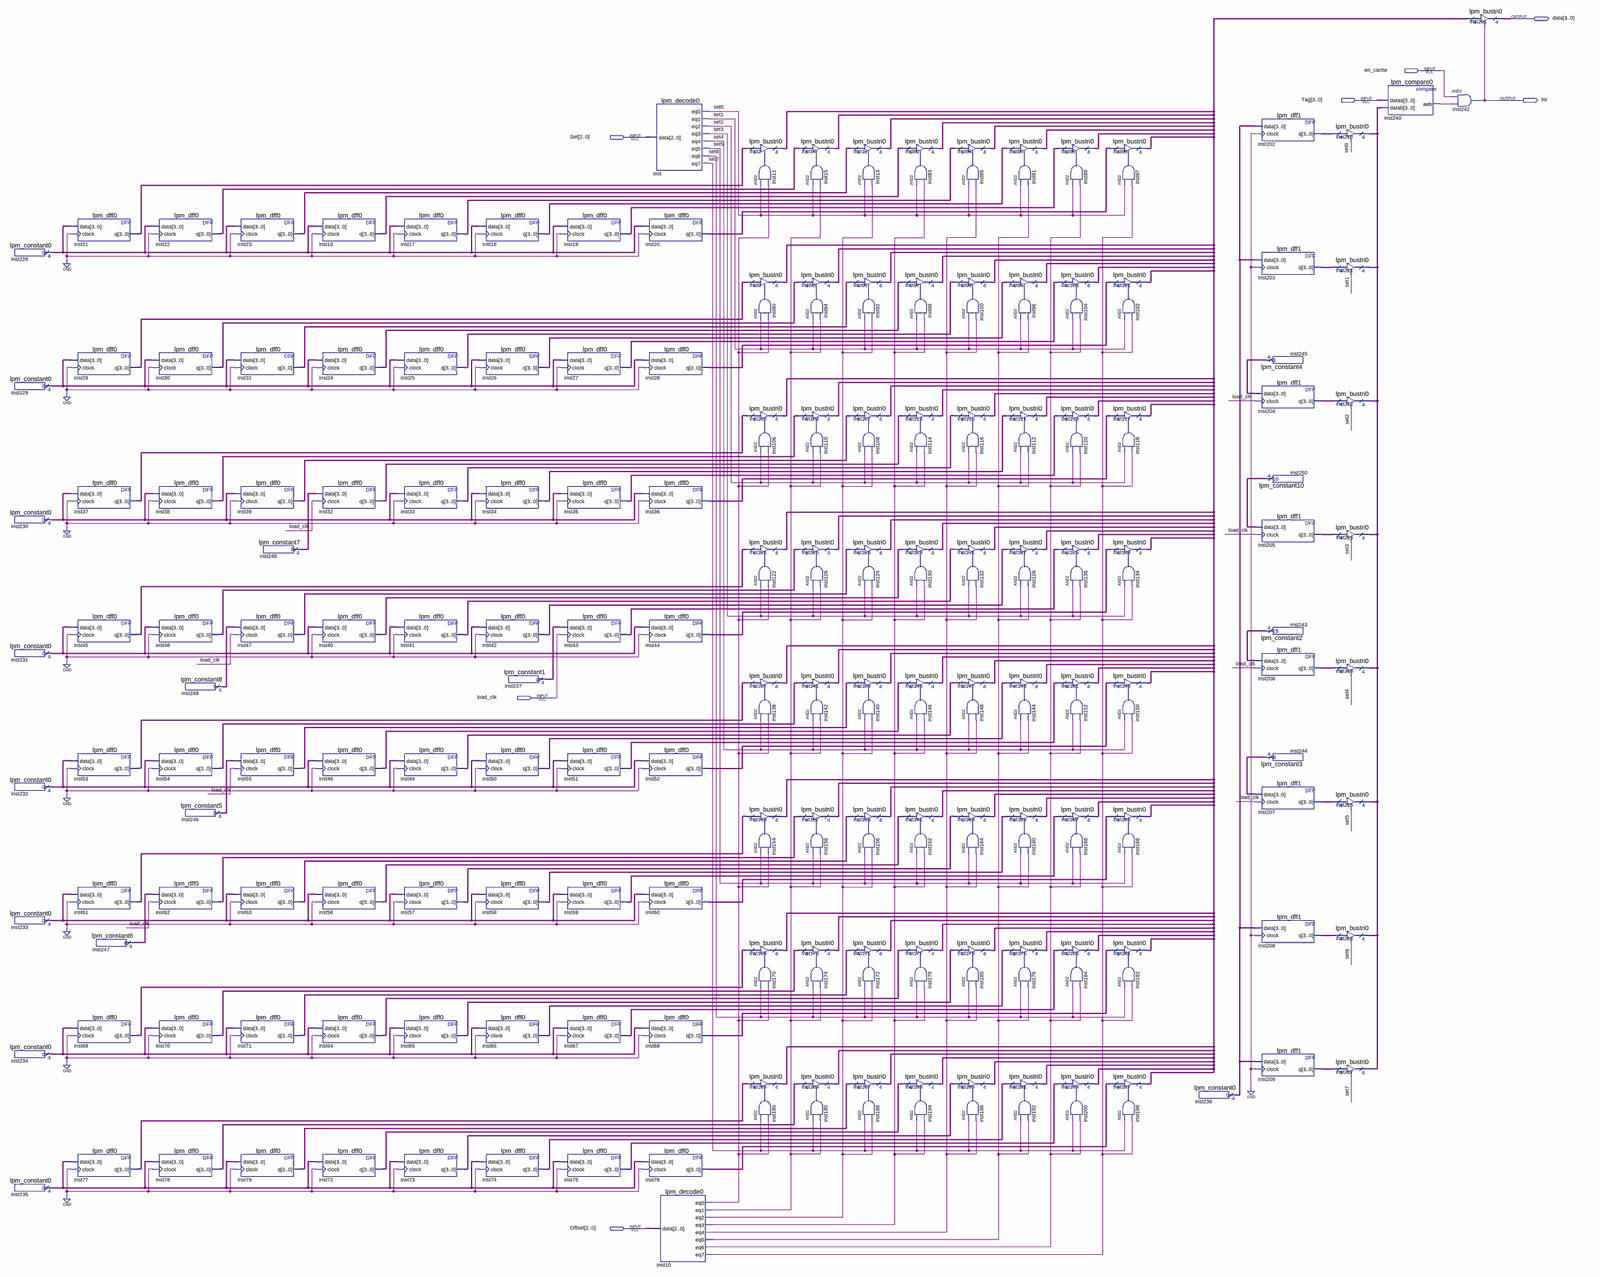
[diagram p0: schematic sheet, whole]
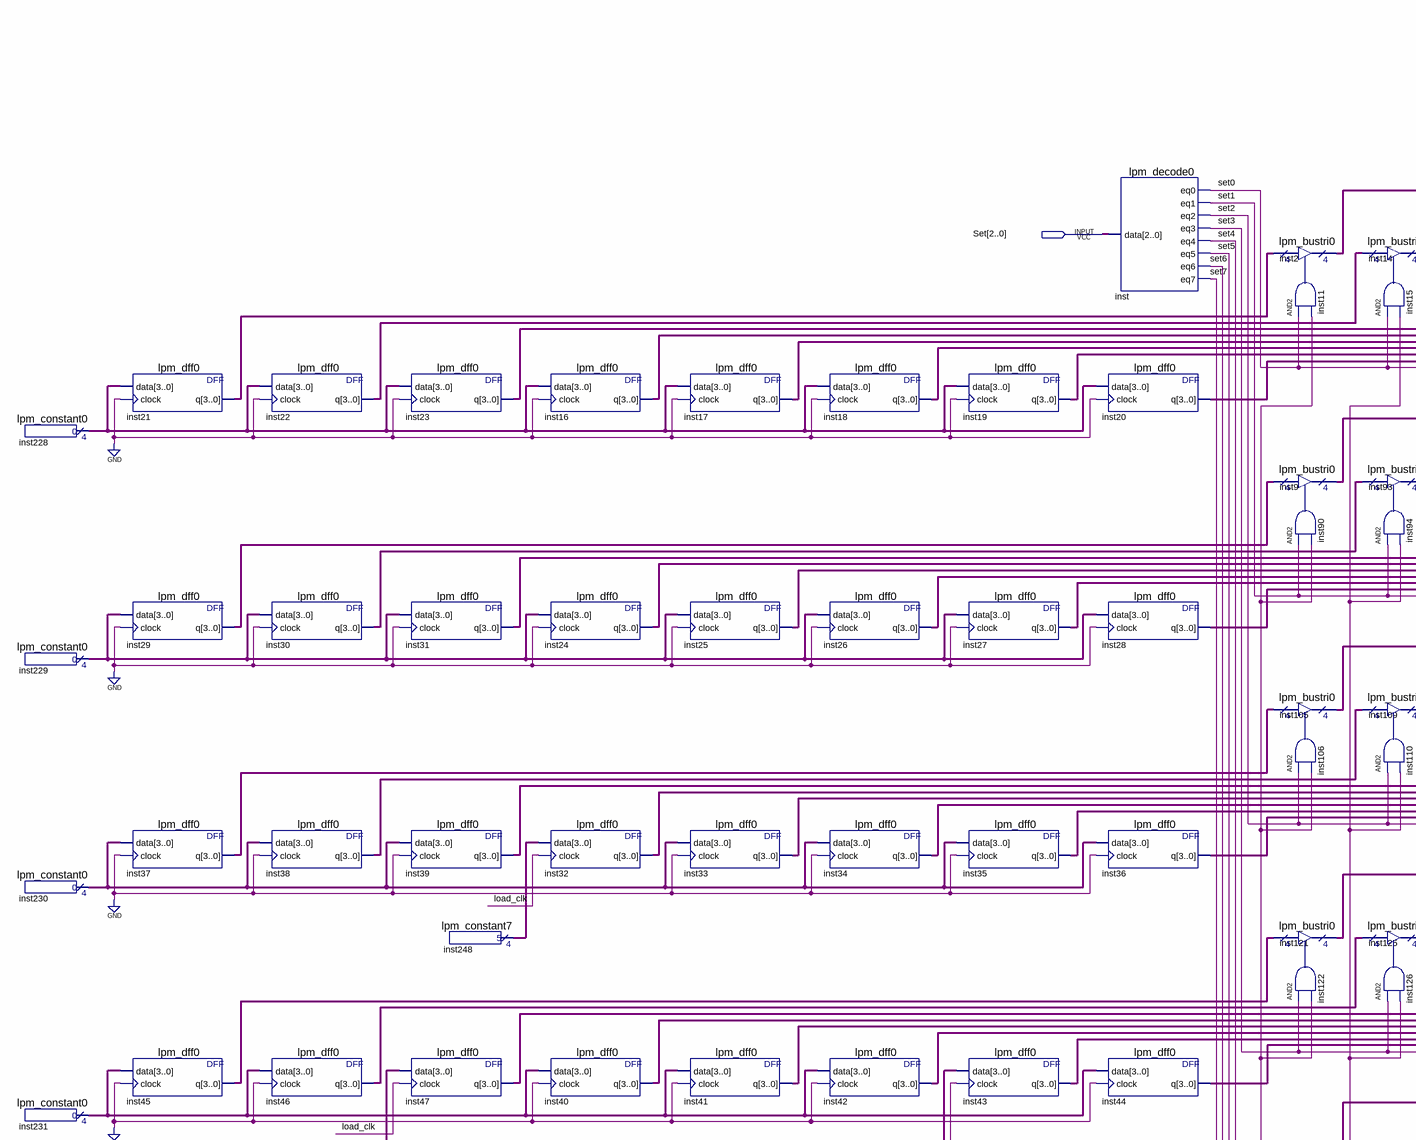
[diagram p1: schematic sheet, upper left part]
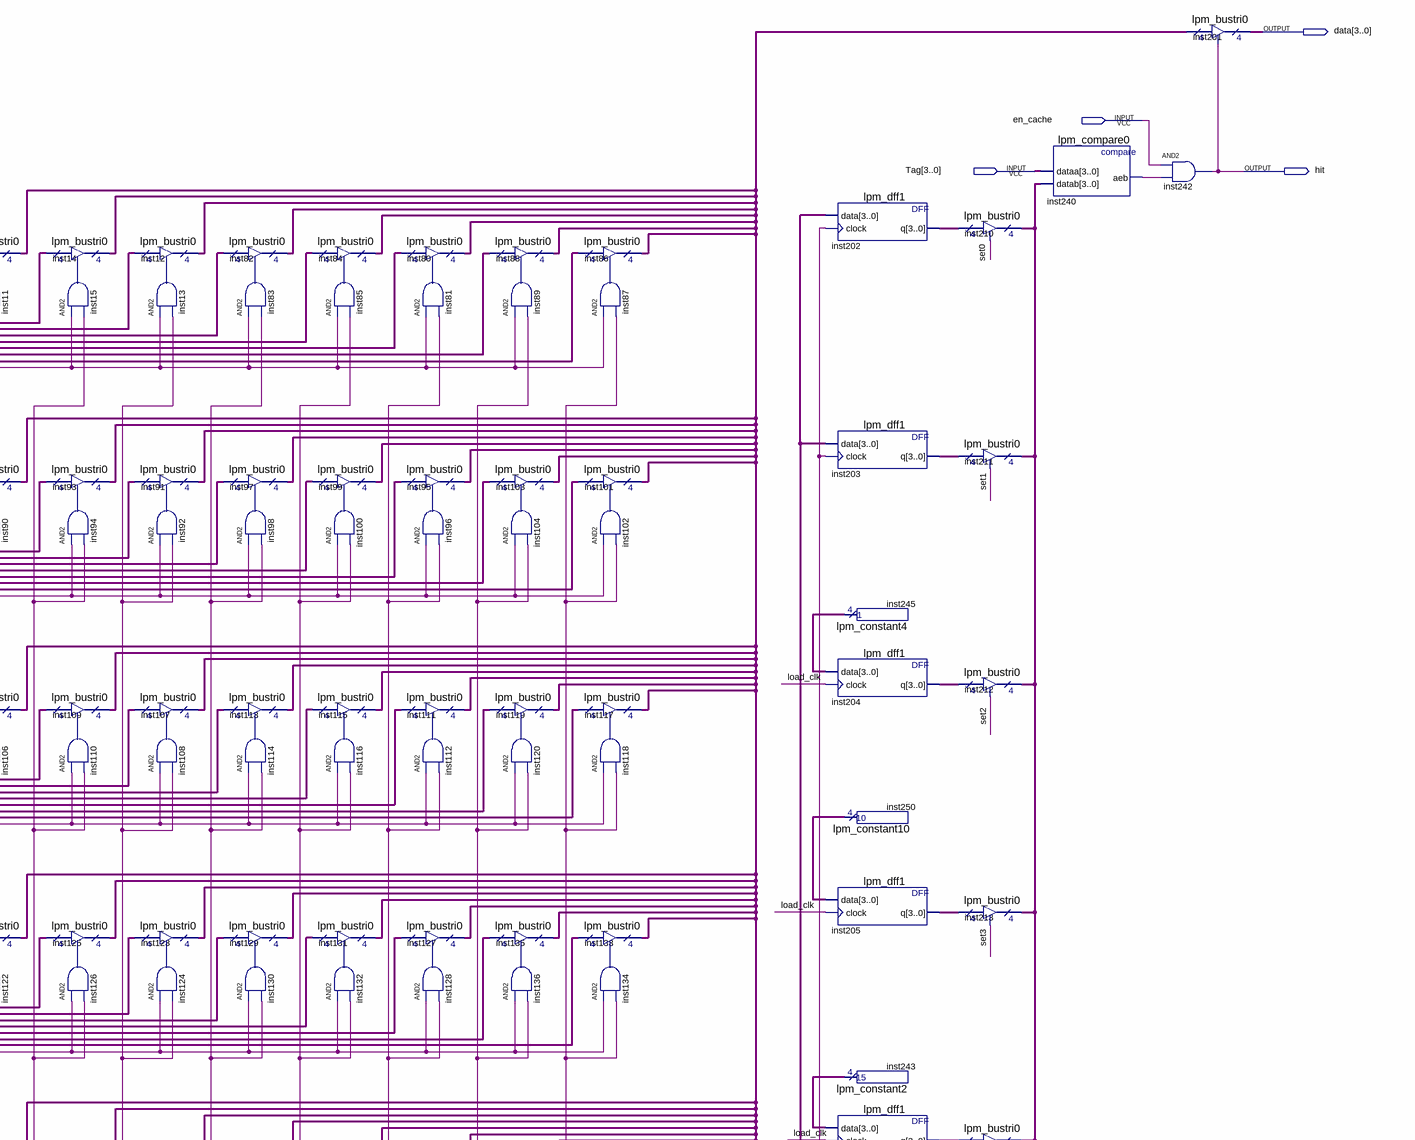
[diagram p2: schematic sheet, upper right part]
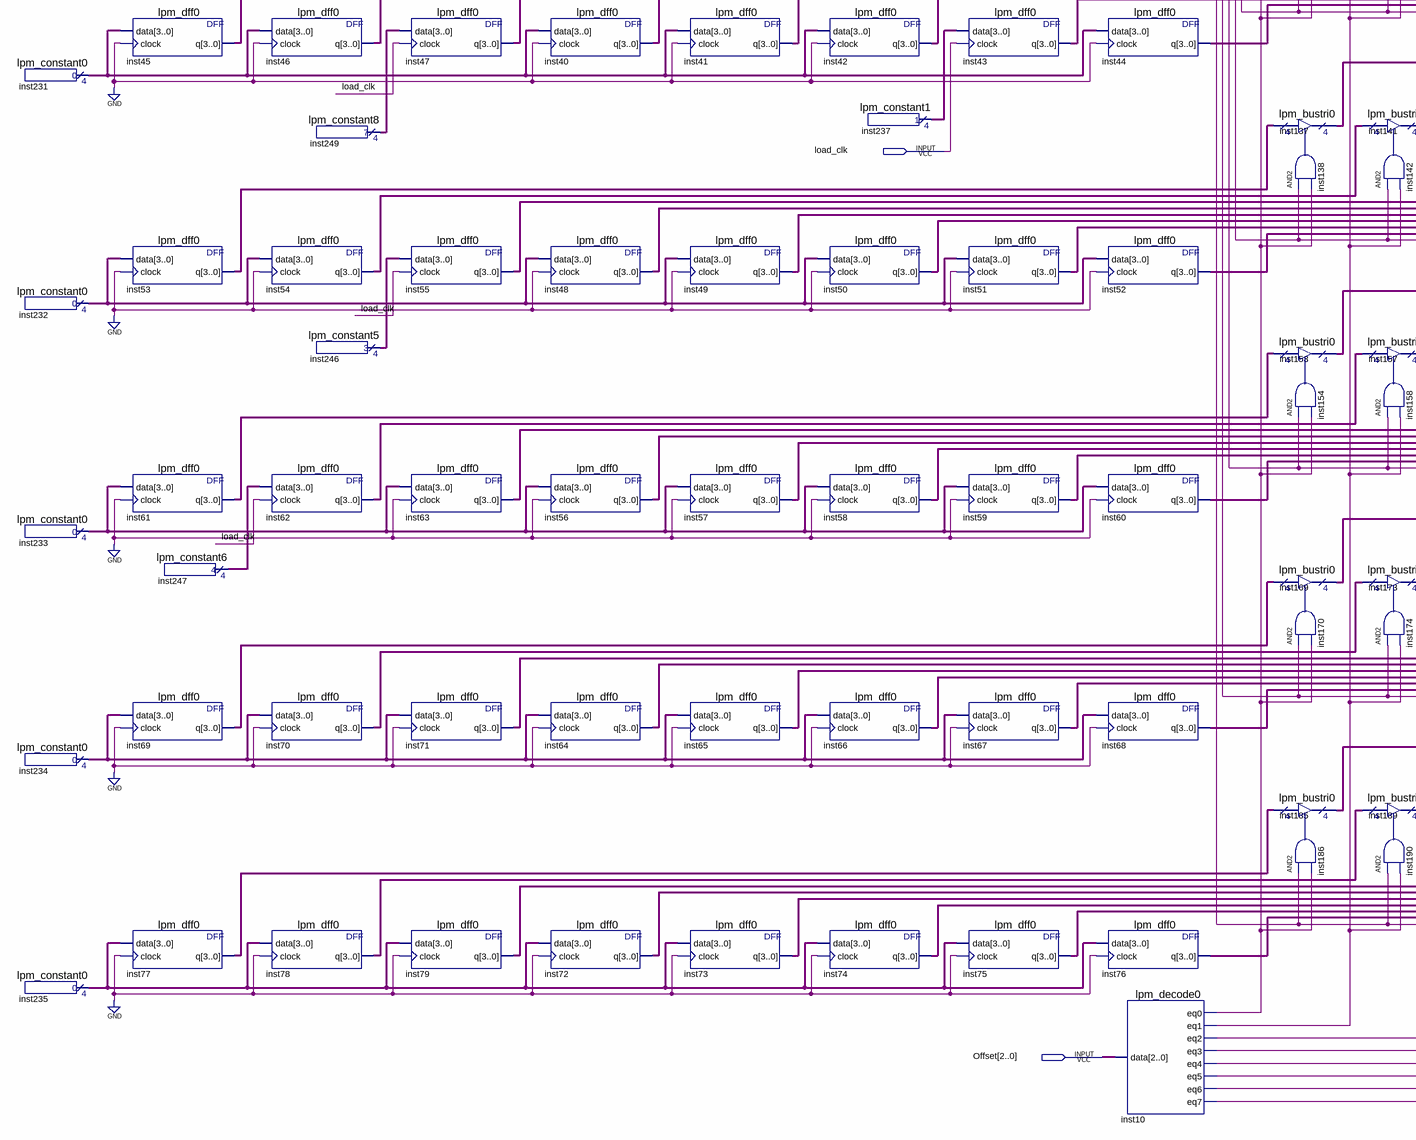
[diagram p3: schematic sheet, lower left part]
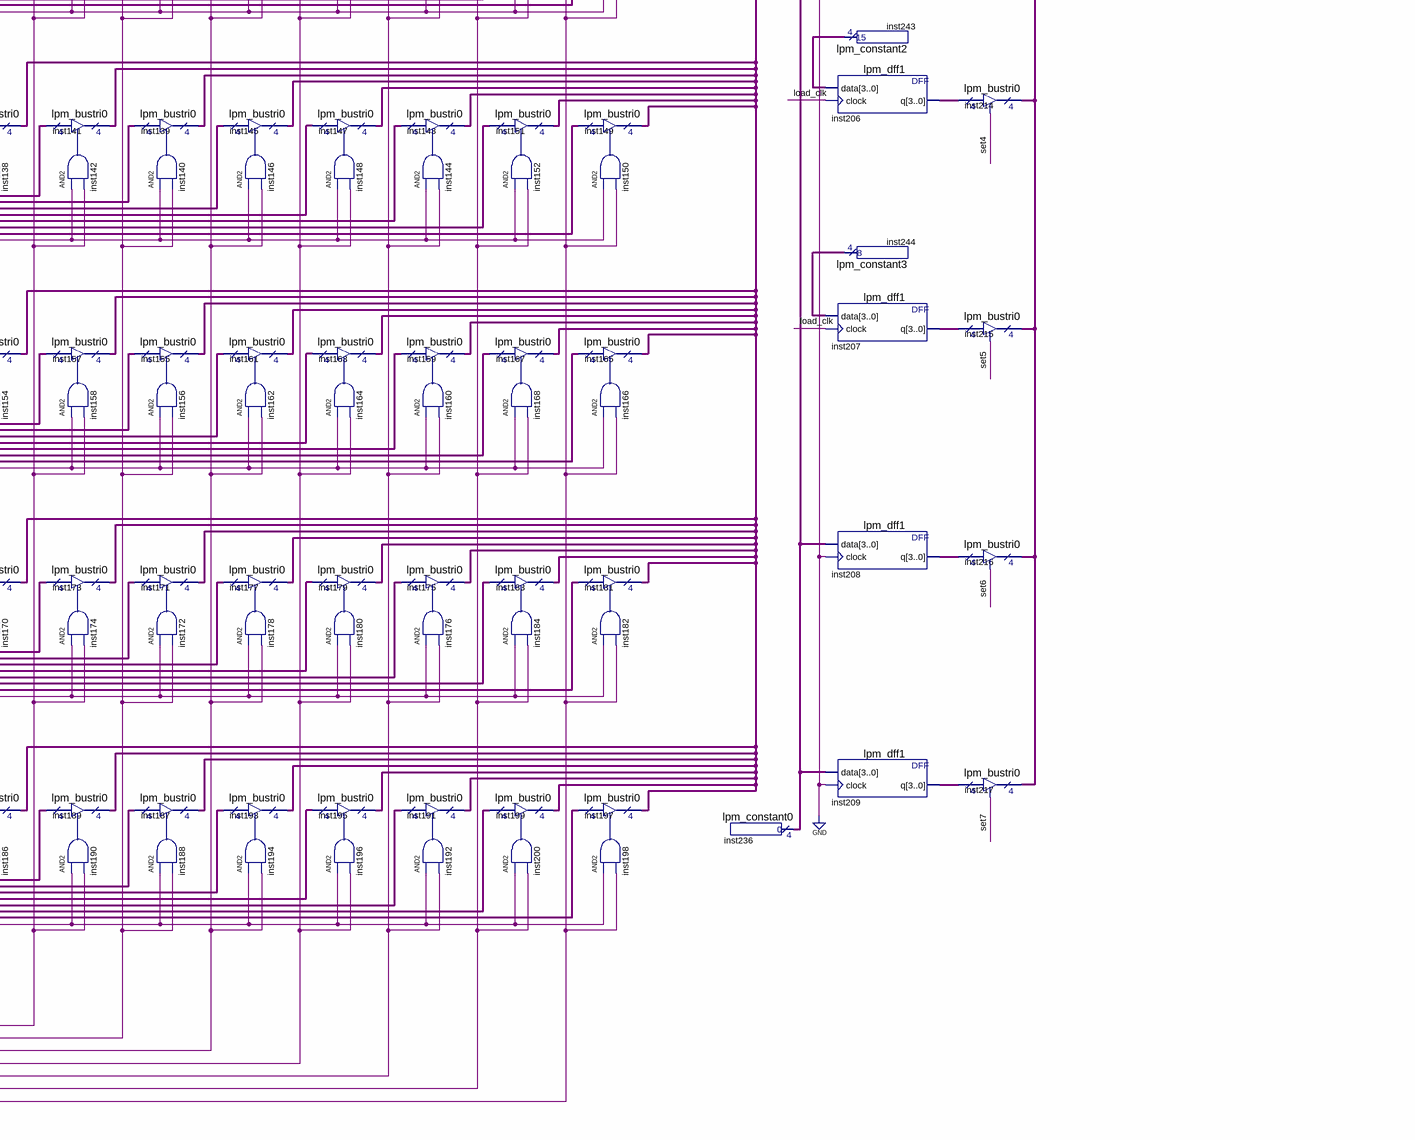
[diagram p4: schematic sheet, lower right part]
// Quartus schematic Cache.bdf as structural Verilog: 231 symbols, 7 pins
module Cache (
  input  en_cache,
  input  [3:0] Tag,
  input  [2:0] Set,
  input  load_clk,
  input  [2:0] Offset,
  output [3:0] data,
  output hit
);

  wire inst10_eq0, inst10_eq1, inst10_eq2, inst10_eq3, inst10_eq4, inst10_eq5, inst10_eq6, inst10_eq7,
       inst11_out, inst13_out, inst15_out, inst81_out, inst83_out, inst85_out, inst87_out, inst89_out,
       inst90_out, inst92_out, inst94_out, inst96_out, inst98_out, inst100_out, inst102_out, inst104_out,
       inst106_out, inst108_out, inst110_out, inst112_out, inst114_out, inst116_out, inst118_out,
       inst120_out, inst122_out, inst124_out, inst126_out, inst128_out, inst130_out, inst132_out,
       inst134_out, inst136_out, inst138_out, inst140_out, inst142_out, inst144_out, inst146_out,
       inst148_out, inst150_out, inst152_out, inst154_out, inst156_out, inst158_out, inst160_out,
       inst162_out, inst164_out, inst166_out, inst168_out, inst170_out, inst172_out, inst174_out,
       inst176_out, inst178_out, inst180_out, inst182_out, inst184_out, inst186_out, inst188_out,
       inst190_out, inst192_out, inst194_out, inst196_out, inst198_out, inst200_out, inst240_aeb, set3, set4,
       set5, set6, set7;
  wire [3:0] inst2_tridata, inst16_q, inst17_q, inst18_q, inst19_q, inst20_q, inst21_q, inst22_q, inst23_q,
       inst24_q, inst25_q, inst26_q, inst27_q, inst28_q, inst29_q, inst30_q, inst31_q, inst32_q, inst33_q,
       inst34_q, inst35_q, inst36_q, inst37_q, inst38_q, inst39_q, inst40_q, inst41_q, inst42_q, inst43_q,
       inst44_q, inst45_q, inst46_q, inst47_q, inst48_q, inst49_q, inst50_q, inst51_q, inst52_q, inst53_q,
       inst54_q, inst55_q, inst56_q, inst57_q, inst58_q, inst59_q, inst60_q, inst61_q, inst62_q, inst63_q,
       inst64_q, inst65_q, inst66_q, inst67_q, inst68_q, inst69_q, inst70_q, inst71_q, inst72_q, inst73_q,
       inst74_q, inst75_q, inst76_q, inst77_q, inst78_q, inst79_q, inst202_q, inst203_q, inst204_q,
       inst205_q, inst206_q, inst207_q, inst208_q, inst209_q, inst210_tridata, inst228_result,
       inst229_result, inst230_result, inst231_result, inst232_result, inst233_result, inst234_result,
       inst235_result, inst236_result, inst237_result, inst243_result, inst244_result, inst245_result,
       inst246_result, inst247_result, inst248_result, inst249_result, inst250_result;

  lpm_constant0 inst228 (.result(inst228_result));
  lpm_constant0 inst229 (.result(inst229_result));
  lpm_constant0 inst230 (.result(inst230_result));
  lpm_constant0 inst231 (.result(inst231_result));
  lpm_constant0 inst232 (.result(inst232_result));
  lpm_constant0 inst233 (.result(inst233_result));
  lpm_constant0 inst234 (.result(inst234_result));
  lpm_constant0 inst235 (.result(inst235_result));
  lpm_dff0 inst21 (.data(inst228_result), .clock(1'b0), .q(inst21_q));
  lpm_dff0 inst29 (.data(inst229_result), .clock(1'b0), .q(inst29_q));
  lpm_dff0 inst37 (.data(inst230_result), .clock(1'b0), .q(inst37_q));
  lpm_dff0 inst45 (.data(inst231_result), .clock(1'b0), .q(inst45_q));
  lpm_dff0 inst53 (.data(inst232_result), .clock(1'b0), .q(inst53_q));
  lpm_dff0 inst61 (.data(inst233_result), .clock(1'b0), .q(inst61_q));
  lpm_dff0 inst69 (.data(inst234_result), .clock(1'b0), .q(inst69_q));
  lpm_dff0 inst77 (.data(inst235_result), .clock(1'b0), .q(inst77_q));
  lpm_constant6 inst247 (.result(inst247_result));
  lpm_dff0 inst22 (.data(inst228_result), .clock(1'b0), .q(inst22_q));
  lpm_dff0 inst30 (.data(inst229_result), .clock(1'b0), .q(inst30_q));
  lpm_dff0 inst38 (.data(inst230_result), .clock(1'b0), .q(inst38_q));
  lpm_dff0 inst46 (.data(inst231_result), .clock(1'b0), .q(inst46_q));
  lpm_dff0 inst54 (.data(inst232_result), .clock(1'b0), .q(inst54_q));
  lpm_dff0 inst62 (.data(inst247_result), .clock(load_clk), .q(inst62_q));
  lpm_dff0 inst70 (.data(inst234_result), .clock(1'b0), .q(inst70_q));
  lpm_dff0 inst78 (.data(inst235_result), .clock(1'b0), .q(inst78_q));
  lpm_constant8 inst249 (.result(inst249_result));
  lpm_constant5 inst246 (.result(inst246_result));
  lpm_dff0 inst23 (.data(inst228_result), .clock(1'b0), .q(inst23_q));
  lpm_dff0 inst31 (.data(inst229_result), .clock(1'b0), .q(inst31_q));
  lpm_dff0 inst39 (.data(inst230_result), .clock(1'b0), .q(inst39_q));
  lpm_constant7 inst248 (.result(inst248_result));
  lpm_dff0 inst47 (.data(inst249_result), .clock(load_clk), .q(inst47_q));
  lpm_dff0 inst55 (.data(inst246_result), .clock(load_clk), .q(inst55_q));
  lpm_dff0 inst63 (.data(inst233_result), .clock(1'b0), .q(inst63_q));
  lpm_dff0 inst71 (.data(inst234_result), .clock(1'b0), .q(inst71_q));
  lpm_dff0 inst79 (.data(inst235_result), .clock(1'b0), .q(inst79_q));
  lpm_dff0 inst16 (.data(inst228_result), .clock(1'b0), .q(inst16_q));
  lpm_dff0 inst24 (.data(inst229_result), .clock(1'b0), .q(inst24_q));
  lpm_dff0 inst32 (.data(inst248_result), .clock(load_clk), .q(inst32_q));
  lpm_dff0 inst40 (.data(inst231_result), .clock(1'b0), .q(inst40_q));
  lpm_dff0 inst48 (.data(inst232_result), .clock(1'b0), .q(inst48_q));
  lpm_dff0 inst56 (.data(inst233_result), .clock(1'b0), .q(inst56_q));
  lpm_dff0 inst64 (.data(inst234_result), .clock(1'b0), .q(inst64_q));
  lpm_dff0 inst72 (.data(inst235_result), .clock(1'b0), .q(inst72_q));
  lpm_dff0 inst17 (.data(inst228_result), .clock(1'b0), .q(inst17_q));
  lpm_dff0 inst25 (.data(inst229_result), .clock(1'b0), .q(inst25_q));
  lpm_dff0 inst33 (.data(inst230_result), .clock(1'b0), .q(inst33_q));
  lpm_dff0 inst41 (.data(inst231_result), .clock(1'b0), .q(inst41_q));
  lpm_dff0 inst49 (.data(inst232_result), .clock(1'b0), .q(inst49_q));
  lpm_dff0 inst57 (.data(inst233_result), .clock(1'b0), .q(inst57_q));
  lpm_dff0 inst65 (.data(inst234_result), .clock(1'b0), .q(inst65_q));
  lpm_dff0 inst73 (.data(inst235_result), .clock(1'b0), .q(inst73_q));
  lpm_dff0 inst18 (.data(inst228_result), .clock(1'b0), .q(inst18_q));
  lpm_dff0 inst26 (.data(inst229_result), .clock(1'b0), .q(inst26_q));
  lpm_dff0 inst34 (.data(inst230_result), .clock(1'b0), .q(inst34_q));
  lpm_dff0 inst42 (.data(inst231_result), .clock(1'b0), .q(inst42_q));
  lpm_dff0 inst50 (.data(inst232_result), .clock(1'b0), .q(inst50_q));
  lpm_dff0 inst58 (.data(inst233_result), .clock(1'b0), .q(inst58_q));
  lpm_dff0 inst66 (.data(inst234_result), .clock(1'b0), .q(inst66_q));
  lpm_dff0 inst74 (.data(inst235_result), .clock(1'b0), .q(inst74_q));
  lpm_constant1 inst237 (.result(inst237_result));
  lpm_dff0 inst19 (.data(inst228_result), .clock(1'b0), .q(inst19_q));
  lpm_dff0 inst27 (.data(inst229_result), .clock(1'b0), .q(inst27_q));
  lpm_dff0 inst35 (.data(inst230_result), .clock(1'b0), .q(inst35_q));
  lpm_dff0 inst43 (.data(inst237_result), .clock(load_clk), .q(inst43_q));
  lpm_dff0 inst51 (.data(inst232_result), .clock(1'b0), .q(inst51_q));
  lpm_dff0 inst59 (.data(inst233_result), .clock(1'b0), .q(inst59_q));
  lpm_dff0 inst67 (.data(inst234_result), .clock(1'b0), .q(inst67_q));
  lpm_dff0 inst75 (.data(inst235_result), .clock(1'b0), .q(inst75_q));
  lpm_dff0 inst20 (.data(inst228_result), .clock(1'b0), .q(inst20_q));
  lpm_dff0 inst28 (.data(inst229_result), .clock(1'b0), .q(inst28_q));
  lpm_dff0 inst36 (.data(inst230_result), .clock(1'b0), .q(inst36_q));
  lpm_dff0 inst44 (.data(inst231_result), .clock(1'b0), .q(inst44_q));
  lpm_dff0 inst52 (.data(inst232_result), .clock(1'b0), .q(inst52_q));
  lpm_dff0 inst60 (.data(inst233_result), .clock(1'b0), .q(inst60_q));
  lpm_dff0 inst68 (.data(inst234_result), .clock(1'b0), .q(inst68_q));
  lpm_dff0 inst76 (.data(inst235_result), .clock(1'b0), .q(inst76_q));
  lpm_decode0 inst (
    .data(Set), .eq0(Set[0]), .eq1(Set[1]), .eq2(Set[2]), .eq3(set3), .eq4(set4), .eq5(set5), .eq6(set6),
    .eq7(set7));
  lpm_decode0 inst10 (
    .data(Offset), .eq0(inst10_eq0), .eq1(inst10_eq1), .eq2(inst10_eq2), .eq3(inst10_eq3), .eq4(inst10_eq4),
    .eq5(inst10_eq5), .eq6(inst10_eq6), .eq7(inst10_eq7));
  lpm_bustri0 inst2 (.enabledt(inst11_out), .data(inst21_q), .tridata(inst2_tridata));
  and inst11 (inst11_out, Set[0], inst10_eq0);
  lpm_bustri0 inst9 (.enabledt(inst90_out), .data(inst29_q), .tridata(inst2_tridata));
  and inst90 (inst90_out, Set[1], inst10_eq0);
  lpm_bustri0 inst105 (.enabledt(inst106_out), .data(inst37_q), .tridata(inst2_tridata));
  and inst106 (inst106_out, Set[2], inst10_eq0);
  lpm_bustri0 inst121 (.enabledt(inst122_out), .data(inst45_q), .tridata(inst2_tridata));
  and inst122 (inst122_out, set3, inst10_eq0);
  lpm_bustri0 inst137 (.enabledt(inst138_out), .data(inst53_q), .tridata(inst2_tridata));
  and inst138 (inst138_out, set4, inst10_eq0);
  lpm_bustri0 inst153 (.enabledt(inst154_out), .data(inst61_q), .tridata(inst2_tridata));
  and inst154 (inst154_out, set5, inst10_eq0);
  lpm_bustri0 inst169 (.enabledt(inst170_out), .data(inst69_q), .tridata(inst2_tridata));
  and inst170 (inst170_out, set6, inst10_eq0);
  lpm_bustri0 inst185 (.enabledt(inst186_out), .data(inst77_q), .tridata(inst2_tridata));
  and inst186 (inst186_out, set7, inst10_eq0);
  lpm_bustri0 inst14 (.enabledt(inst15_out), .data(inst22_q), .tridata(inst2_tridata));
  and inst15 (inst15_out, Set[0], inst10_eq1);
  lpm_bustri0 inst93 (.enabledt(inst94_out), .data(inst30_q), .tridata(inst2_tridata));
  and inst94 (inst94_out, Set[1], inst10_eq1);
  lpm_bustri0 inst109 (.enabledt(inst110_out), .data(inst38_q), .tridata(inst2_tridata));
  and inst110 (inst110_out, Set[2], inst10_eq1);
  lpm_bustri0 inst125 (.enabledt(inst126_out), .data(inst46_q), .tridata(inst2_tridata));
  and inst126 (inst126_out, set3, inst10_eq1);
  lpm_bustri0 inst141 (.enabledt(inst142_out), .data(inst54_q), .tridata(inst2_tridata));
  and inst142 (inst142_out, set4, inst10_eq1);
  lpm_bustri0 inst157 (.enabledt(inst158_out), .data(inst62_q), .tridata(inst2_tridata));
  and inst158 (inst158_out, set5, inst10_eq1);
  lpm_bustri0 inst173 (.enabledt(inst174_out), .data(inst70_q), .tridata(inst2_tridata));
  and inst174 (inst174_out, set6, inst10_eq1);
  lpm_bustri0 inst189 (.enabledt(inst190_out), .data(inst78_q), .tridata(inst2_tridata));
  and inst190 (inst190_out, set7, inst10_eq1);
  lpm_bustri0 inst12 (.enabledt(inst13_out), .data(inst23_q), .tridata(inst2_tridata));
  lpm_bustri0 inst91 (.enabledt(inst92_out), .data(inst31_q), .tridata(inst2_tridata));
  lpm_bustri0 inst107 (.enabledt(inst108_out), .data(inst39_q), .tridata(inst2_tridata));
  lpm_bustri0 inst123 (.enabledt(inst124_out), .data(inst47_q), .tridata(inst2_tridata));
  lpm_bustri0 inst139 (.enabledt(inst140_out), .data(inst55_q), .tridata(inst2_tridata));
  lpm_bustri0 inst155 (.enabledt(inst156_out), .data(inst63_q), .tridata(inst2_tridata));
  lpm_bustri0 inst171 (.enabledt(inst172_out), .data(inst71_q), .tridata(inst2_tridata));
  lpm_bustri0 inst187 (.enabledt(inst188_out), .data(inst79_q), .tridata(inst2_tridata));
  and inst13 (inst13_out, Set[0], inst10_eq2);
  and inst92 (inst92_out, Set[1], inst10_eq2);
  and inst108 (inst108_out, Set[2], inst10_eq2);
  and inst124 (inst124_out, set3, inst10_eq2);
  and inst140 (inst140_out, set4, inst10_eq2);
  and inst156 (inst156_out, set5, inst10_eq2);
  and inst172 (inst172_out, set6, inst10_eq2);
  and inst188 (inst188_out, set7, inst10_eq2);
  lpm_bustri0 inst82 (.enabledt(inst83_out), .data(inst16_q), .tridata(inst2_tridata));
  and inst83 (inst83_out, Set[0], inst10_eq3);
  lpm_bustri0 inst97 (.enabledt(inst98_out), .data(inst24_q), .tridata(inst2_tridata));
  and inst98 (inst98_out, Set[1], inst10_eq3);
  lpm_bustri0 inst113 (.enabledt(inst114_out), .data(inst32_q), .tridata(inst2_tridata));
  and inst114 (inst114_out, Set[2], inst10_eq3);
  lpm_bustri0 inst129 (.enabledt(inst130_out), .data(inst40_q), .tridata(inst2_tridata));
  and inst130 (inst130_out, set3, inst10_eq3);
  lpm_bustri0 inst145 (.enabledt(inst146_out), .data(inst48_q), .tridata(inst2_tridata));
  and inst146 (inst146_out, set4, inst10_eq3);
  lpm_bustri0 inst161 (.enabledt(inst162_out), .data(inst56_q), .tridata(inst2_tridata));
  and inst162 (inst162_out, set5, inst10_eq3);
  lpm_bustri0 inst177 (.enabledt(inst178_out), .data(inst64_q), .tridata(inst2_tridata));
  and inst178 (inst178_out, set6, inst10_eq3);
  lpm_bustri0 inst193 (.enabledt(inst194_out), .data(inst72_q), .tridata(inst2_tridata));
  and inst194 (inst194_out, set7, inst10_eq3);
  lpm_bustri0 inst84 (.enabledt(inst85_out), .data(inst17_q), .tridata(inst2_tridata));
  and inst85 (inst85_out, Set[0], inst10_eq4);
  lpm_bustri0 inst99 (.enabledt(inst100_out), .data(inst25_q), .tridata(inst2_tridata));
  and inst100 (inst100_out, Set[1], inst10_eq4);
  lpm_bustri0 inst115 (.enabledt(inst116_out), .data(inst33_q), .tridata(inst2_tridata));
  and inst116 (inst116_out, Set[2], inst10_eq4);
  lpm_bustri0 inst131 (.enabledt(inst132_out), .data(inst41_q), .tridata(inst2_tridata));
  and inst132 (inst132_out, set3, inst10_eq4);
  lpm_bustri0 inst147 (.enabledt(inst148_out), .data(inst49_q), .tridata(inst2_tridata));
  and inst148 (inst148_out, set4, inst10_eq4);
  lpm_bustri0 inst163 (.enabledt(inst164_out), .data(inst57_q), .tridata(inst2_tridata));
  and inst164 (inst164_out, set5, inst10_eq4);
  lpm_bustri0 inst179 (.enabledt(inst180_out), .data(inst65_q), .tridata(inst2_tridata));
  and inst180 (inst180_out, set6, inst10_eq4);
  lpm_bustri0 inst195 (.enabledt(inst196_out), .data(inst73_q), .tridata(inst2_tridata));
  and inst196 (inst196_out, set7, inst10_eq4);
  lpm_bustri0 inst80 (.enabledt(inst81_out), .data(inst18_q), .tridata(inst2_tridata));
  and inst81 (inst81_out, Set[0], inst10_eq5);
  lpm_bustri0 inst95 (.enabledt(inst96_out), .data(inst26_q), .tridata(inst2_tridata));
  and inst96 (inst96_out, Set[1], inst10_eq5);
  lpm_bustri0 inst111 (.enabledt(inst112_out), .data(inst34_q), .tridata(inst2_tridata));
  and inst112 (inst112_out, Set[2], inst10_eq5);
  lpm_bustri0 inst127 (.enabledt(inst128_out), .data(inst42_q), .tridata(inst2_tridata));
  and inst128 (inst128_out, set3, inst10_eq5);
  lpm_bustri0 inst143 (.enabledt(inst144_out), .data(inst50_q), .tridata(inst2_tridata));
  and inst144 (inst144_out, set4, inst10_eq5);
  lpm_bustri0 inst159 (.enabledt(inst160_out), .data(inst58_q), .tridata(inst2_tridata));
  and inst160 (inst160_out, set5, inst10_eq5);
  lpm_bustri0 inst175 (.enabledt(inst176_out), .data(inst66_q), .tridata(inst2_tridata));
  and inst176 (inst176_out, set6, inst10_eq5);
  lpm_bustri0 inst191 (.enabledt(inst192_out), .data(inst74_q), .tridata(inst2_tridata));
  and inst192 (inst192_out, set7, inst10_eq5);
  lpm_bustri0 inst88 (.enabledt(inst89_out), .data(inst19_q), .tridata(inst2_tridata));
  lpm_bustri0 inst103 (.enabledt(inst104_out), .data(inst27_q), .tridata(inst2_tridata));
  lpm_bustri0 inst119 (.enabledt(inst120_out), .data(inst35_q), .tridata(inst2_tridata));
  lpm_bustri0 inst135 (.enabledt(inst136_out), .data(inst43_q), .tridata(inst2_tridata));
  lpm_bustri0 inst151 (.enabledt(inst152_out), .data(inst51_q), .tridata(inst2_tridata));
  lpm_bustri0 inst167 (.enabledt(inst168_out), .data(inst59_q), .tridata(inst2_tridata));
  lpm_bustri0 inst183 (.enabledt(inst184_out), .data(inst67_q), .tridata(inst2_tridata));
  lpm_bustri0 inst199 (.enabledt(inst200_out), .data(inst75_q), .tridata(inst2_tridata));
  and inst89 (inst89_out, Set[0], inst10_eq6);
  and inst104 (inst104_out, Set[1], inst10_eq6);
  and inst120 (inst120_out, Set[2], inst10_eq6);
  and inst136 (inst136_out, set3, inst10_eq6);
  and inst152 (inst152_out, set4, inst10_eq6);
  and inst168 (inst168_out, set5, inst10_eq6);
  and inst184 (inst184_out, set6, inst10_eq6);
  and inst200 (inst200_out, set7, inst10_eq6);
  lpm_bustri0 inst86 (.enabledt(inst87_out), .data(inst20_q), .tridata(inst2_tridata));
  and inst87 (inst87_out, Set[0], inst10_eq7);
  lpm_bustri0 inst101 (.enabledt(inst102_out), .data(inst28_q), .tridata(inst2_tridata));
  and inst102 (inst102_out, Set[1], inst10_eq7);
  lpm_bustri0 inst117 (.enabledt(inst118_out), .data(inst36_q), .tridata(inst2_tridata));
  and inst118 (inst118_out, Set[2], inst10_eq7);
  lpm_bustri0 inst133 (.enabledt(inst134_out), .data(inst44_q), .tridata(inst2_tridata));
  and inst134 (inst134_out, set3, inst10_eq7);
  lpm_bustri0 inst149 (.enabledt(inst150_out), .data(inst52_q), .tridata(inst2_tridata));
  and inst150 (inst150_out, set4, inst10_eq7);
  lpm_bustri0 inst165 (.enabledt(inst166_out), .data(inst60_q), .tridata(inst2_tridata));
  and inst166 (inst166_out, set5, inst10_eq7);
  lpm_bustri0 inst181 (.enabledt(inst182_out), .data(inst68_q), .tridata(inst2_tridata));
  and inst182 (inst182_out, set6, inst10_eq7);
  lpm_bustri0 inst197 (.enabledt(inst198_out), .data(inst76_q), .tridata(inst2_tridata));
  and inst198 (inst198_out, set7, inst10_eq7);
  lpm_constant0 inst236 (.result(inst236_result));
  lpm_dff1 inst202 (.data(inst236_result), .clock(1'b0), .q(inst202_q));
  lpm_dff1 inst203 (.data(inst236_result), .clock(1'b0), .q(inst203_q));
  lpm_constant4 inst245 (.result(inst245_result));
  lpm_dff1 inst204 (.data(inst245_result), .clock(load_clk), .q(inst204_q));
  lpm_constant10 inst250 (.result(inst250_result));
  lpm_dff1 inst205 (.data(inst250_result), .clock(load_clk), .q(inst205_q));
  lpm_constant2 inst243 (.result(inst243_result));
  lpm_dff1 inst206 (.data(inst243_result), .clock(load_clk), .q(inst206_q));
  lpm_constant3 inst244 (.result(inst244_result));
  lpm_dff1 inst207 (.data(inst244_result), .clock(load_clk), .q(inst207_q));
  lpm_dff1 inst208 (.data(inst236_result), .clock(1'b0), .q(inst208_q));
  lpm_dff1 inst209 (.data(inst236_result), .clock(1'b0), .q(inst209_q));
  lpm_bustri0 inst210 (.enabledt(Set[0]), .data(inst202_q), .tridata(inst210_tridata));
  lpm_bustri0 inst211 (.enabledt(Set[1]), .data(inst203_q), .tridata(inst210_tridata));
  lpm_bustri0 inst212 (.enabledt(Set[2]), .data(inst204_q), .tridata(inst210_tridata));
  lpm_bustri0 inst213 (.enabledt(set3), .data(inst205_q), .tridata(inst210_tridata));
  lpm_bustri0 inst214 (.enabledt(set4), .data(inst206_q), .tridata(inst210_tridata));
  lpm_bustri0 inst215 (.enabledt(set5), .data(inst207_q), .tridata(inst210_tridata));
  lpm_bustri0 inst216 (.enabledt(set6), .data(inst208_q), .tridata(inst210_tridata));
  lpm_bustri0 inst217 (.enabledt(set7), .data(inst209_q), .tridata(inst210_tridata));
  lpm_compare0 inst240 (.dataa(Tag), .datab(inst210_tridata), .aeb(inst240_aeb));
  lpm_bustri0 inst201 (.enabledt(hit), .data(inst2_tridata), .tridata(data));
  and inst242 (hit, en_cache, inst240_aeb);
endmodule
